# EAGLE design v1microcontroller (EAGLE 9.0.0)
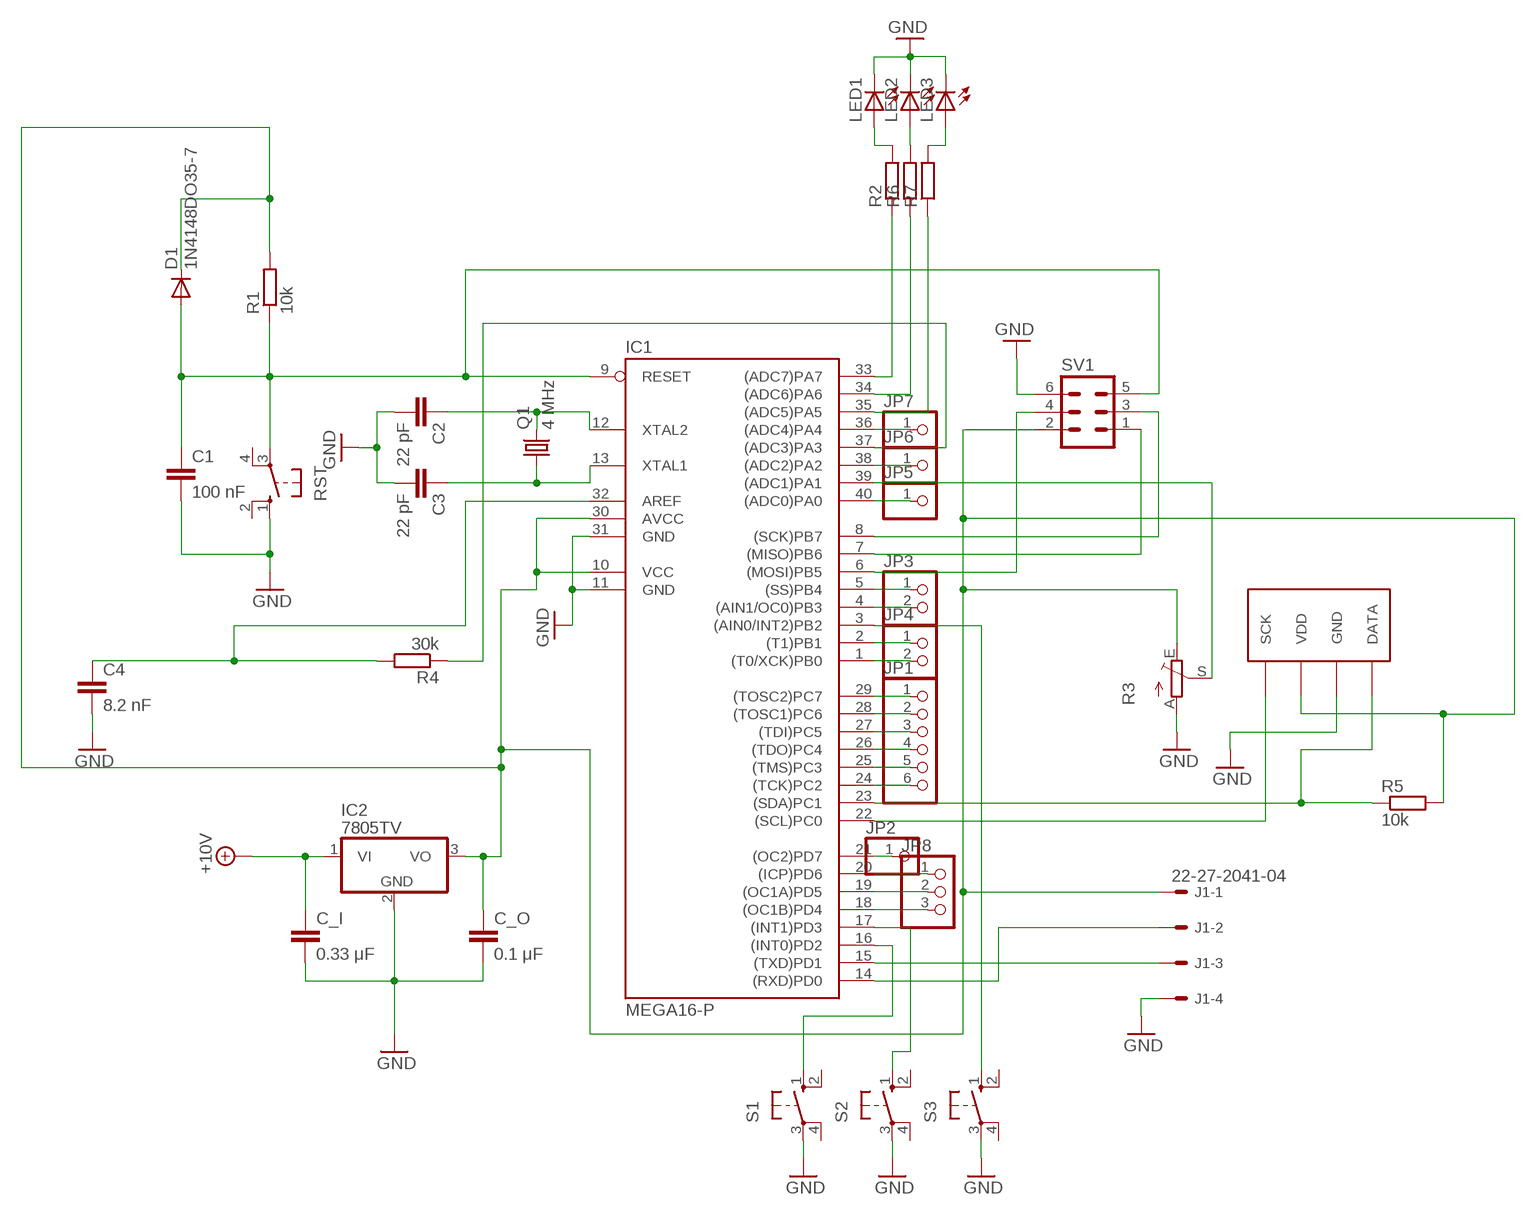
[diagram p0: schematic, sheet 1]

## Parts
C1  100 nF  C2,5-3  [C2.5-3]
C2  22 pF  C2,5-3  [C2.5-3]
C3  22 pF  C2,5-3  [C2.5-3]
C4  8.2 nF  C2,5-3  [C2.5-3]
C_I  0.33 μF  C2,5-3  [C2.5-3]
C_O  0.1 μF  C2,5-3  [C2.5-3]
D1  1N4148DO35-7  [DO35-7]
IC1  MEGA16-P  [DIL40]
IC2  7805TV  [TO220V]
J1  22-27-2041-04  [6410-04]
JP1  PINHD-1X6  [1X06]
JP2  PINHD-1X1  [1X01]
JP3  PINHD-1X2  [1X02]
JP4  PINHD-1X2  [1X02]
JP5  PINHD-1X1  [1X01]
JP6  PINHD-1X1  [1X01]
JP7  PINHD-1X1  [1X01]
JP8  PINHD-1X3  [1X03]
LED1  LED5MM  [LED5MM]
LED2  LED5MM  [LED5MM]
LED3  LED5MM  [LED5MM]
Q1  4 MHz  CRYSTALHC49U-V  [HC49U-V]
R1  10k  R-EU_0204/5  [0204/5]
R2  R-EU_0204/5  [0204/5]
R3  TRIM_EU-CT6  [CT6]
R4  30k  R-EU_0204/5  [0204/5]
R5  10k  R-EU_0204/5  [0204/5]
R6  R-EU_0204/5  [0204/5]
R7  R-EU_0204/5  [0204/5]
RST  10-XX  [B3F-10XX]
S1  10-XX  [B3F-10XX]
S2  10-XX  [B3F-10XX]
S3  10-XX  [B3F-10XX]
SV1  ML6  [ML6]
U$1  SHT71  [SHT7X]

## Nets
+10V: C_I.1 IC2.1(VI)
GND: C1.2 C2.2 C3.2 C4.2 C_I.2 C_O.2 IC1.11(GND) IC1.31(GND) IC2.2(GND) J1.4 LED1.K(C) LED2.K(C) LED3.K(C) R3.A RST.1(S) S1.3(P) S2.3(P) S3.3(P) SV1.6 U$1.3(GND)
N$1: C1.1 D1.A IC1.9(RESET) R1.1 RST.3(P) SV1.5
N$2: LED3.A R7.2
N$3 [test]: C_O.1 D1.C IC1.10(VCC) IC1.30(AVCC) IC2.3(VO) J1.1 R1.2 R3.E R5.2 SV1.2 U$1.2(VDD)
N$4: IC1.33((ADC7)PA7) R2.1
N$5: IC1.7((MISO)PB6) SV1.1
N$6: IC1.6((MOSI)PB5) SV1.4
N$7: LED2.A R6.2
N$8: C2.1 IC1.12(XTAL2) Q1.2
N$9: C3.1 IC1.13(XTAL1) Q1.1
N$10: IC1.39((ADC1)PA1) R3.S
N$11: LED1.A R2.2
N$12: IC1.21((OC2)PD7) JP2.1
N$13: C4.1 IC1.32(AREF) R4.2
N$14: IC1.8((SCK)PB7) SV1.3
N$15: IC1.20((ICP)PD6) JP8.1
N$16: IC1.19((OC1A)PD5) JP8.2
N$17: IC1.18((OC1B)PD4) JP8.3
N$18: IC1.29((TOSC2)PC7) JP1.1
N$19: IC1.15((TXD)PD1) J1.3
N$20: IC1.14((RXD)PD0) J1.2
N$21: IC1.16((INT0)PD2) S1.1(S)
N$22: IC1.17((INT1)PD3) S2.1(S)
N$23: IC1.3((AIN0/INT2)PB2) S3.1(S)
N$24: IC1.22((SCL)PC0) U$1.1(SCK)
N$25: IC1.23((SDA)PC1) R5.1 U$1.4(DATA)
N$26: IC1.28((TOSC1)PC6) JP1.2
N$27: IC1.27((TDI)PC5) JP1.3
N$28: IC1.26((TDO)PC4) JP1.4
N$29: IC1.25((TMS)PC3) JP1.5
N$30: IC1.24((TCK)PC2) JP1.6
N$31: IC1.5((SS)PB4) JP3.1
N$32: IC1.4((AIN1/OC0)PB3) JP3.2
N$33: IC1.2((T1)PB1) JP4.1
N$34: IC1.1((T0/XCK)PB0) JP4.2
N$35: IC1.34((ADC6)PA6) R6.1
N$36: IC1.35((ADC5)PA5) R7.1
N$37: IC1.40((ADC0)PA0) JP5.1
N$38: IC1.37((ADC3)PA3) R4.1
N$39: IC1.38((ADC2)PA2) JP6.1
N$40: IC1.36((ADC4)PA4) JP7.1
Unconnected: RST.2(S1) RST.4(P1) S1.2(S1) S1.4(P1) S2.2(S1) S2.4(P1) S3.2(S1) S3.4(P1)

## Library data of the parts
C1-C4 C_I C_O = capacitor-wima:C: CAPACITOR naming: grid - package width
D1 = diode:1N4148: DIODE high speed (Philips)
IC1 = atmel:MEGA16-P: MICROCONTROLLER 16 Kbytes FLASH 1 kbytes SRAM 512 bytes EEPROM USART 8-channel 10 bit ADC Source: avr.lbr; MPN: ATMEGA16-16PU; OC_FARNELL: 9171142; OC_NEWARK: 01M6885
IC2 = linear:78*: Positive VOLTAGE REGULATOR Source: http://cache.national.com/ds/LM/LM78L05.pdf http://www.fairchildsemi.com/ds/LM/LM7805.pdf; SPICEPREFIX: J
J1 = con-molex:22-?-04: CONNECTOR wire to board 2.54 mm (.1 inch) pitch header; MF: MOLEX; OC_FARNELL: unknown; OC_NEWARK: unknown
JP1 = pinhead:PINHD-1X6: PIN HEADER
JP2 JP5-JP7 = pinhead:PINHD-1X1: PIN HEADER
JP3 JP4 = pinhead:PINHD-1X2: PIN HEADER
JP8 = pinhead:PINHD-1X3: PIN HEADER
LED1-LED3 = led:LED: LED OSRAM: - CHIPLED LG R971, LG N971, LY N971, LG Q971, LY Q971, LO R971, LY R971 LH N974, LH R974 LS Q976, LO Q976, LY Q976 LO Q996 - Hyper CHIPLED LW Q18S LB Q993, LB Q99A, LB R99A - SideLED LS A670, LO A670, LY A670, LG A670, LP A670 LB A673, LV A673, LT A673, LW A673 LH A674 LY A675 LS A676, LA A676, LO A676, LY A676, LW A676 LS A679, LY A679, LG A679 - Hyper Micro SIDELED® LS Y876, LA Y876, LO Y876, LY Y876 LT Y87S - SmartLED LW L88C, LW L88S LB L89C, LB L89S, LG L890 LS L89K, LO L89K, LY L89K LS L896, LA L896, LO L896, LY L896 - TOPLED LS T670, LO T670, LY T670, LG T670, LP T670 LSG T670, LSP T670, LSY T670, LOP T670, LYG T670 LG T671, LOG T671, LSG T671 LB T673, LV T673, LT T673, LW T673 LH T674 LS T676, LA T676, LO T676, LY T676, LB T676, LH T676, LSB T676, LW T676 LB T67C, LV T67C, LT T67C, LS T67K, LO T67K, LY T67K, LW E67C LS E67B, LA E67B, LO E67B, LY E67B, LB E67C, LV E67C, LT E67C LW T67C LS T679, LY T679, LG T679 LS T770, LO T770, LY T770, LG T770, LP T770 LB T773, LV T773, LT T773, LW T773 LH T774 LS E675, LA E675, LY E675, LS T675 LS T776, LA T776, LO T776, LY T776, LB T776 LHGB T686 LT T68C, LB T68C - Hyper Mini TOPLED® LB M676 - Mini TOPLED Santana® LG M470 LS M47K, LO M47K, LY M47K Source: http://www.osram.convergy.de LUXEON: - LUMILED® LXK2-PW12-R00, LXK2-PW12-S00, LXK2-PW14-U00, LXK2-PW14-V00 LXK2-PM12-R00, LXK2-PM12-S00, LXK2-PM14-U00 LXK2-PE12-Q00, LXK2-PE12-R00, LXK2-PE12-S00, LXK2-PE14-T00, LXK2-PE14-U00 LXK2-PB12-K00, LXK2-PB12-L00, LXK2-PB12-M00, LXK2-PB14-N00, LXK2-PB14-P00, LXK2-PB14-Q00 LXK2-PR12-L00, LXK2-PR12-M00, LXK2-PR14-Q00, LXK2-PR14-R00 LXK2-PD12-Q00, LXK2-PD12-R00, LXK2-PD12-S00 LXK2-PH12-R00, LXK2-PH12-S00 LXK2-PL12-P00, LXK2-PL12-Q00, LXK2-PL12-R00 Source: www.luxeon.com KINGBRIGHT: KA-3528ASYC Source: www.kingbright.com
Q1 = crystal:CRYSTAL: CRYSTAL; OC_FARNELL: 1666969; OC_NEWARK: unknown
R1 R2 R4-R7 = resistor:R-EU_: RESISTOR, European symbol
R3 = pot:TRIM_EU-: POTENTIOMETER
RST S1-S3 = switch-omron:10-XX: OMRON SWITCH; MPN: B3F-1000; OC_FARNELL: 176432; OC_NEWARK: 36M3542
SV1 = con-ml:ML6: HARTING; OC_FARNELL: unknown; OC_NEWARK: unknown
U$1 = sht11:SHT71

## Net classes
0 default: width 0.305 mm
1 test: width 1 mm

## Board
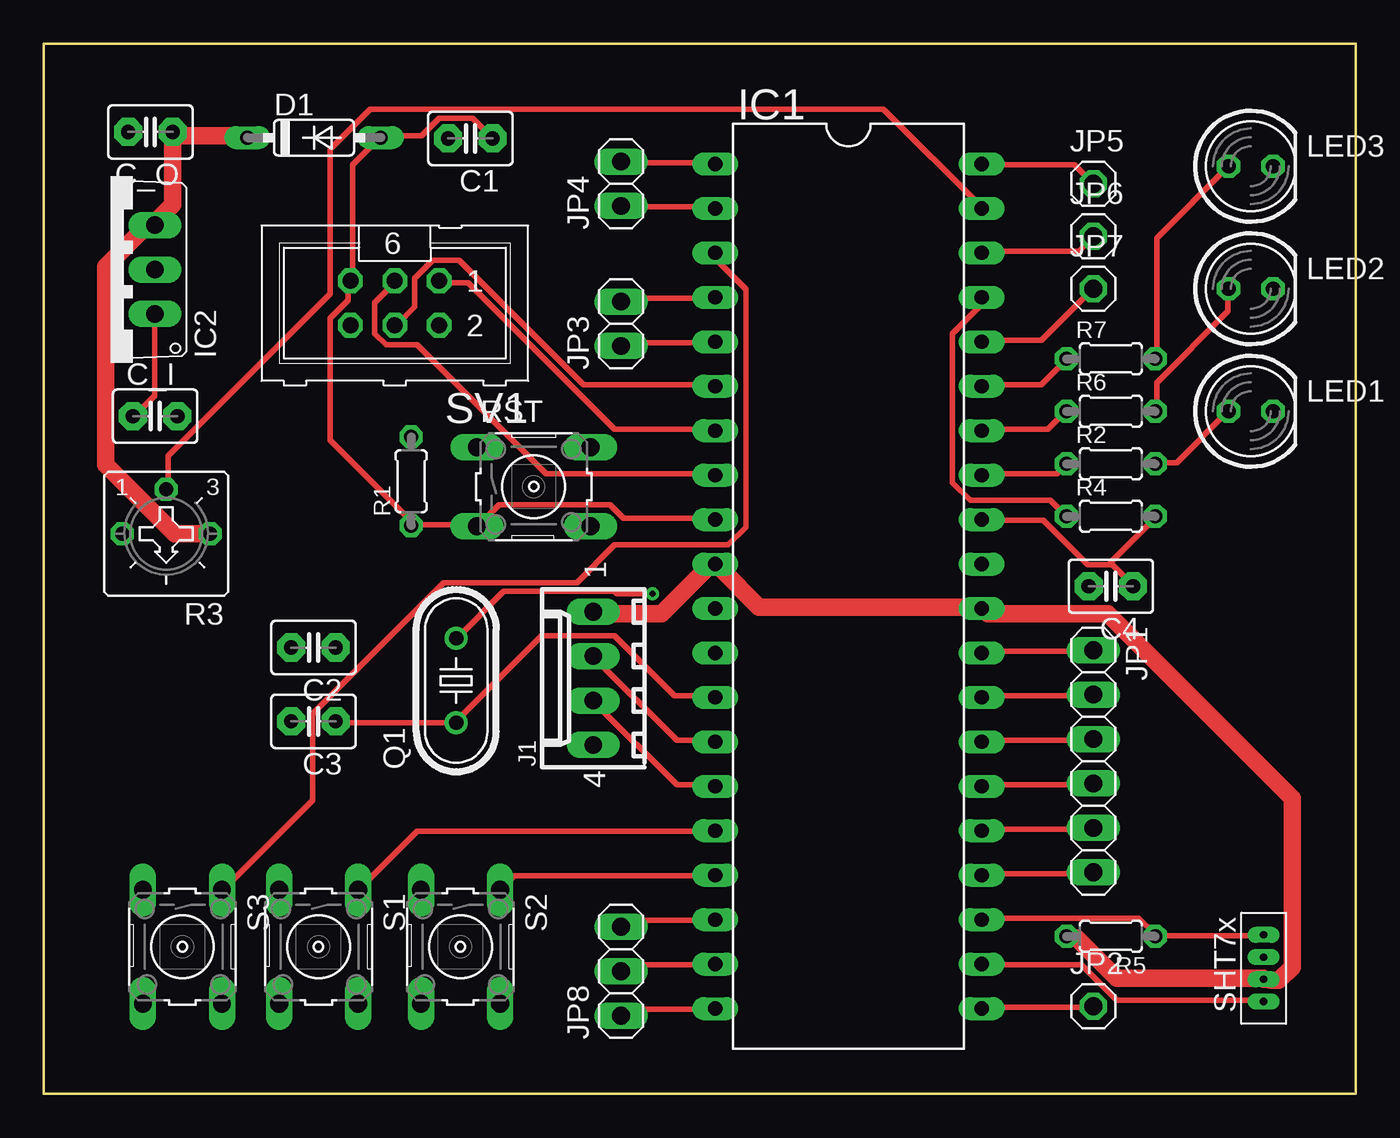
[diagram p1: board, top side]
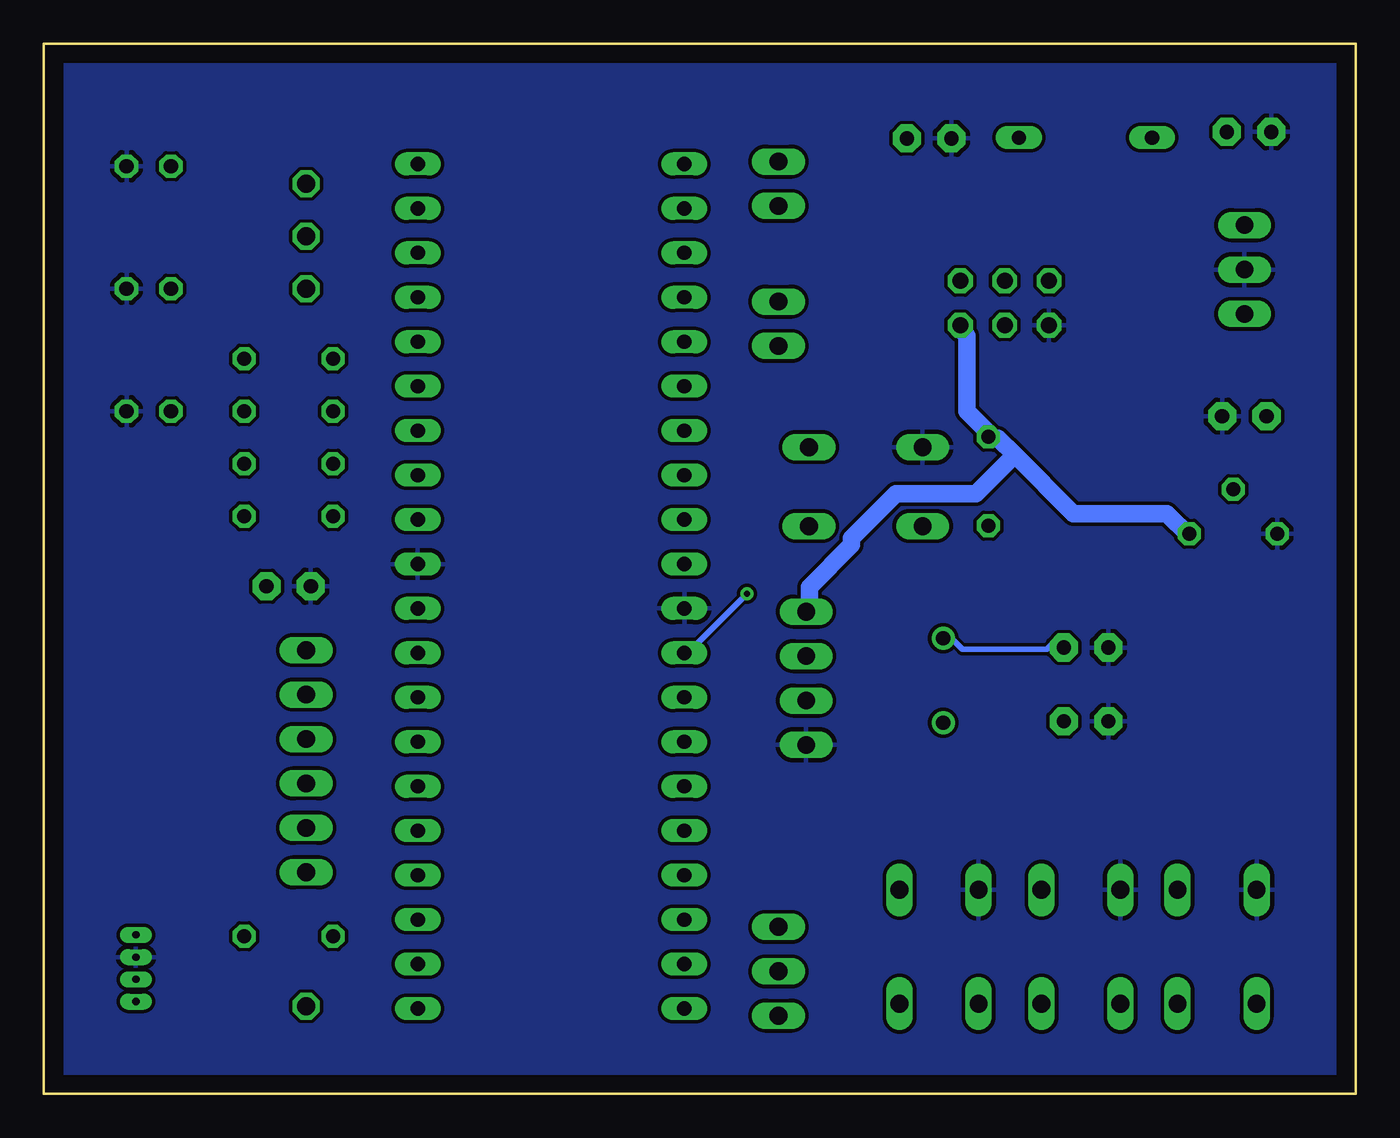
[diagram p2: board, bottom side, seen from below]

Size 75 x 60 mm. Coordinates in mm from the lower left corner, seen from the top.
Outline: 0,0 0,60 75,60 75,0 0,0
Copper layers (1*16): Top 0.035mm / dielectric 1.5mm / Bottom 0.035mm
Design rules "default *": minimum track width 8mil, minimum drill 0.35mm, track to track 8mil, track to pad 8mil, pad to pad 8mil, via to via 8mil, smd to smd 8mil, copper to edge 40mil, drill to drill 6mil, minimum pad ring 10mil, minimum via ring 8mil, stop-mask expansion 4mil, vias tented up to drill 0mil, thermal gap 10mil

### Footprints (pad centres in the part's own frame; a part is rotated, then mirrored left to right if it is on the bottom)
C2.5-3 = drill 0.813 pad 1.6 octagon: 1 -1.27,0; 2 1.27,0
DO35-7 = drill 0.813 long: A 3.81,0; C -3.81,0
DIL40 = drill 0.813 long: 1 -24.13,-7.62; 2 -21.59,-7.62; 3 -19.05,-7.62; 4 -16.51,-7.62; 5 -13.97,-7.62; 6 -11.43,-7.62; 7 -8.89,-7.62; 8 -6.35,-7.62; 9 -3.81,-7.62; 10 -1.27,-7.62; 11 1.27,-7.62; 12 3.81,-7.62; 13 6.35,-7.62; 14 8.89,-7.62; 15 11.43,-7.62; 16 13.97,-7.62; 17 16.51,-7.62; 18 19.05,-7.62; 19 21.59,-7.62; 20 24.13,-7.62; 21 24.13,7.62; 22 21.59,7.62; 23 19.05,7.62; 24 16.51,7.62; 25 13.97,7.62; 26 11.43,7.62; 27 8.89,7.62; 28 6.35,7.62; 29 3.81,7.62; 30 1.27,7.62; 31 -1.27,7.62; 32 -3.81,7.62; 33 -6.35,7.62; 34 -8.89,7.62; 35 -11.43,7.62; 36 -13.97,7.62; 37 -16.51,7.62; 38 -19.05,7.62; 39 -21.59,7.62; 40 -24.13,7.62
TO220V = drill 1.016 long: 1 -2.54,-2.54; 2 0,-2.54; 3 2.54,-2.54
6410-04 = drill 1.016 long: 1 3.81,0; 2 1.27,0; 3 -1.27,0; 4 -3.81,0
1X06 = drill 1.016 long: 1 -6.35,0; 2 -3.81,0; 3 -1.27,0; 4 1.27,0; 5 3.81,0; 6 6.35,0
1X01 = drill 1.016 octagon: 1 0,0
1X02 = drill 1.016 long: 1 -1.27,0; 2 1.27,0
1X03 = drill 1.016 long: 1 -2.54,0; 2 0,0; 3 2.54,0
LED5MM = drill 0.813 octagon: A -1.27,0; K 1.27,0
HC49U-V = drill 0.813: 1 -2.413,0; 2 2.413,0
0204/5 = drill 0.813 octagon: 1 -2.54,0; 2 2.54,0
CT6 = drill 0.813 octagon: A 2.515,0; E -2.515,0; S 0,-2.54
B3F-10XX = drill 1.016 long: 1 -3.251,2.261; 2 3.251,2.261; 3 -3.251,-2.261; 4 3.251,-2.261
ML6 = drill 0.914 octagon: 1 -2.54,-1.27; 2 -2.54,1.27; 3 0,-1.27; 4 0,1.27; 5 2.54,-1.27; 6 2.54,1.27
SHT7X = drill 0.406 pad 0.813 long: 1 1.27,1.27; 2 2.54,1.27; 3 3.81,1.27; 4 5.08,1.27

### Placement (x,y rotation side)
C1  24.39,54.59 180 top
C2  15.42,25.5 180 top
C3  15.42,21.28 180 top
C4  61,29 180 top
C_I  6.37,38.72 0 top
C_O  6.1,54.96 180 top
D1  15.45,54.63 0 top
IC1  46,29 270 top
IC2  3.82,47.1 90 top
J1  31.42,23.74 90 top
JP1  60,19 270 top
JP2  60,5 0 top
JP3  33,44 90 top
JP4  33,52 90 top
JP5  60,52 0 top
JP6  60,49 0 top
JP7  60,46 0 top
JP8  33,7 90 top
LED1  69,39 0 top
LED2  69,46 0 top
LED3  69,53 0 top
Q1  23.58,23.61 90 top
R1  21,35 90 top
R2  61,36 0 top
R3  7,32 180 top
R4  61,33 0 top
R5  61,9 180 top
R6  61,39 0 top
R7  61,42 0 top
RST  28.01,34.69 0 top
S1  15.71,8.4 270 top
S2  23.82,8.4 270 top
S3  7.93,8.4 270 top
SV1  20.07,45.18 180 top
U$1  71,4 90 top

### Tracks (layer width: path | path; a pad name or v marks a point on that pad's centre or on a via)
+10V
  Top 0.305: IC2.1 6.35,44.45 6.35,39.88 5.21,38.73 C_I.1
GND
  pour Bottom: 1,59 74,59 74,1 1,1
N$1
  Top 0.305: C1.1 25.65,54.61 24.51,55.75 22.61,55.75 21.59,54.74 19.3,54.74 D1.A 19.18,54.61 17.65,53.09 17.65,46.48 SV1.5 17.4,46.35 17.4,45.34 16.38,44.32 16.38,37.34 21.08,32.64 R1.1 21.08,32.51 24.64,32.51 RST.3 24.89,32.51 26.04,33.66 32.38,33.66 33.15,32.89 38.35,32.89 IC1.9
N$2
  Top 0.305: R7.2 63.63,42.04 63.63,48.9 67.69,52.96 LED3.A
N$3
  Top 1: D1.C 11.56,54.74 7.62,54.74 7.49,54.86 C_O.1 7.37,54.36 7.37,50.8 6.6,50.04 IC2.3 6.35,49.53 5.84,49.53 3.56,47.24 3.56,35.94 7.49,32 9.4,32 R3.E | R5.2 58.55,8.89 59.05,8.89 61.34,6.6 69.72,6.6 U$1.2 70.23,6.48 70.61,6.48 71.37,7.24 71.37,16.89 60.83,27.43 53.98,27.43 IC1.30 53.59,27.81 40.89,27.81 38.73,29.97 IC1.10 38.35,30.23 38.1,30.23 35.31,27.43 31.5,27.43 J1.1
  Bottom 1: SV1.2 22.73,43.81 22.23,43.31 22.23,38.99 20.95,37.72 20.95,37.59 R1.2 20.45,37.47 19.49,36.51 | 19.49,36.51 16.13,33.15 10.79,33.15 9.53,31.88 R3.E | 19.49,36.51 21.72,34.29 26.29,34.29 28.83,31.75 28.83,31.37 31.24,28.96 31.24,27.69 31.37,27.56 J1.1
N$4
  Top 0.305: IC1.33 53.72,35.43 57.91,35.43 58.42,35.94 R2.1
N$5
  Top 0.305: IC1.7 38.35,37.97 32.64,37.97 24.26,46.35 22.73,46.35 SV1.1
N$6
  Top 0.305: IC1.6 38.35,40.51 30.86,40.51 23.75,47.62 22.23,47.62 21.21,46.61 21.21,44.96 20.19,43.94 SV1.4
N$7
  Top 0.305: R6.2 63.63,39.12 63.63,40.64 67.69,44.7 67.69,45.97 LED2.A
N$8  (via drill 0.35)
  Top 0.305: v34.8,28.57 32.77,28.57 32.64,28.7 26.29,28.7 23.62,26.04 Q1.2
  Bottom 0.305: Q1.2 23.5,25.91 22.99,25.91 22.48,25.4 17.65,25.4 17.4,25.65 16.89,25.65 16.76,25.53 C2.1 | v34.8,28.57 38.1,25.27 38.35,25.27 IC1.12
N$9
  Top 0.305: C3.1 16.76,21.21 23.5,21.21 Q1.1 23.62,21.34 28.45,26.16 32.64,26.16 36.07,22.73 38.35,22.73 IC1.13
N$10
  Top 0.305: R3.S 7.11,34.54 7.11,36.45 16.38,45.72 16.38,53.98 18.67,56.26 48.01,56.26 53.59,50.67 IC1.39
N$11
  Top 0.305: R2.2 63.63,36.07 64.77,36.07 67.69,38.99 LED1.A
N$12
  Top 0.305: IC1.21 53.72,4.95 59.94,4.95 JP2.1
N$13
  Top 0.305: 60.96,30.23 61.09,30.23 62.23,29.08 C4.1 | 60.96,30.23 59.69,30.23 57.15,32.77 53.72,32.77 IC1.32 | R4.2 63.5,32.89 60.96,30.35 60.96,30.23
N$14
  Top 0.305: IC1.8 38.35,35.43 28.7,35.43 21.34,42.8 19.56,42.8 18.92,43.43 18.92,45.21 20.07,46.35 SV1.3
N$15
  Top 0.305: IC1.20 38.35,4.83 33.27,4.83 33.02,4.57 JP8.1
N$16
  Top 0.305: IC1.19 38.35,7.37 33.27,7.37 33.02,7.11 JP8.2
N$17
  Top 0.305: IC1.18 38.35,9.91 33.27,9.91 33.02,9.65 JP8.3
N$18
  Top 0.305: IC1.29 53.72,25.27 59.94,25.27 JP1.1
N$19
  Top 0.305: IC1.15 38.35,17.65 36.2,17.65 31.5,22.35 J1.3
N$20
  Top 0.305: IC1.14 38.35,20.19 36.2,20.19 31.5,24.89 J1.2
N$21
  Top 0.305: IC1.16 38.35,14.99 21.34,14.99 18.03,11.68 S1.1
N$22
  Top 0.305: IC1.17 38.35,12.45 26.92,12.45 26.16,11.68 S2.1
N$23
  Top 0.305: IC1.3 38.48,48.01 38.48,47.62 40.13,45.97 40.13,32.38 39.12,31.37 32.64,31.37 30.48,29.21 22.86,29.21 15.37,21.72 15.37,16.76 10.29,11.68 S3.1
N$24
  Top 0.305: U$1.1 69.72,5.33 61.34,5.33 59.31,7.37 53.72,7.37 IC1.22
N$25
  Top 0.305: U$1.4 69.72,9.02 63.63,9.02 R5.1 63.5,9.14 62.61,10.03 53.72,10.03 IC1.23
N$26
  Top 0.305: IC1.28 53.72,22.73 59.94,22.73 JP1.2
N$27
  Top 0.305: IC1.27 53.72,20.19 59.94,20.19 JP1.3
N$28
  Top 0.305: IC1.26 53.72,17.65 59.94,17.65 JP1.4
N$29
  Top 0.305: IC1.25 53.72,15.11 59.94,15.11 JP1.5
N$30
  Top 0.305: IC1.24 53.72,12.57 59.94,12.57 JP1.6
N$31
  Top 0.305: IC1.5 38.35,42.93 33.15,42.93 33.02,42.8 JP3.1
N$32
  Top 0.305: IC1.4 38.35,45.47 33.15,45.47 33.02,45.34 JP3.2
N$33
  Top 0.305: IC1.2 38.35,50.67 33.02,50.67 JP4.1
N$34
  Top 0.305: IC1.1 38.35,53.21 33.02,53.21 JP4.2
N$35
  Top 0.305: IC1.34 53.72,37.97 57.4,37.97 58.42,38.99 R6.1
N$36
  Top 0.305: IC1.35 53.72,40.51 57.02,40.51 58.42,41.91 R7.1
N$37
  Top 0.305: IC1.40 53.72,53.09 58.93,53.09 59.94,52.07 JP5.1
N$38
  Top 0.305: IC1.37 53.59,45.47 53.59,45.09 51.94,43.43 51.94,34.92 52.96,33.91 57.53,33.91 58.42,33.02 R4.1
N$39
  Top 0.305: IC1.38 53.72,48.13 59.18,48.13 59.94,48.9 JP6.1
N$40
  Top 0.305: IC1.36 53.72,43.05 57.02,43.05 59.94,45.97 JP7.1